# Altium schematic sheet MainSchematic.SchDoc
size OrCAD B; SheetNumber: 1; SheetTotal: 3
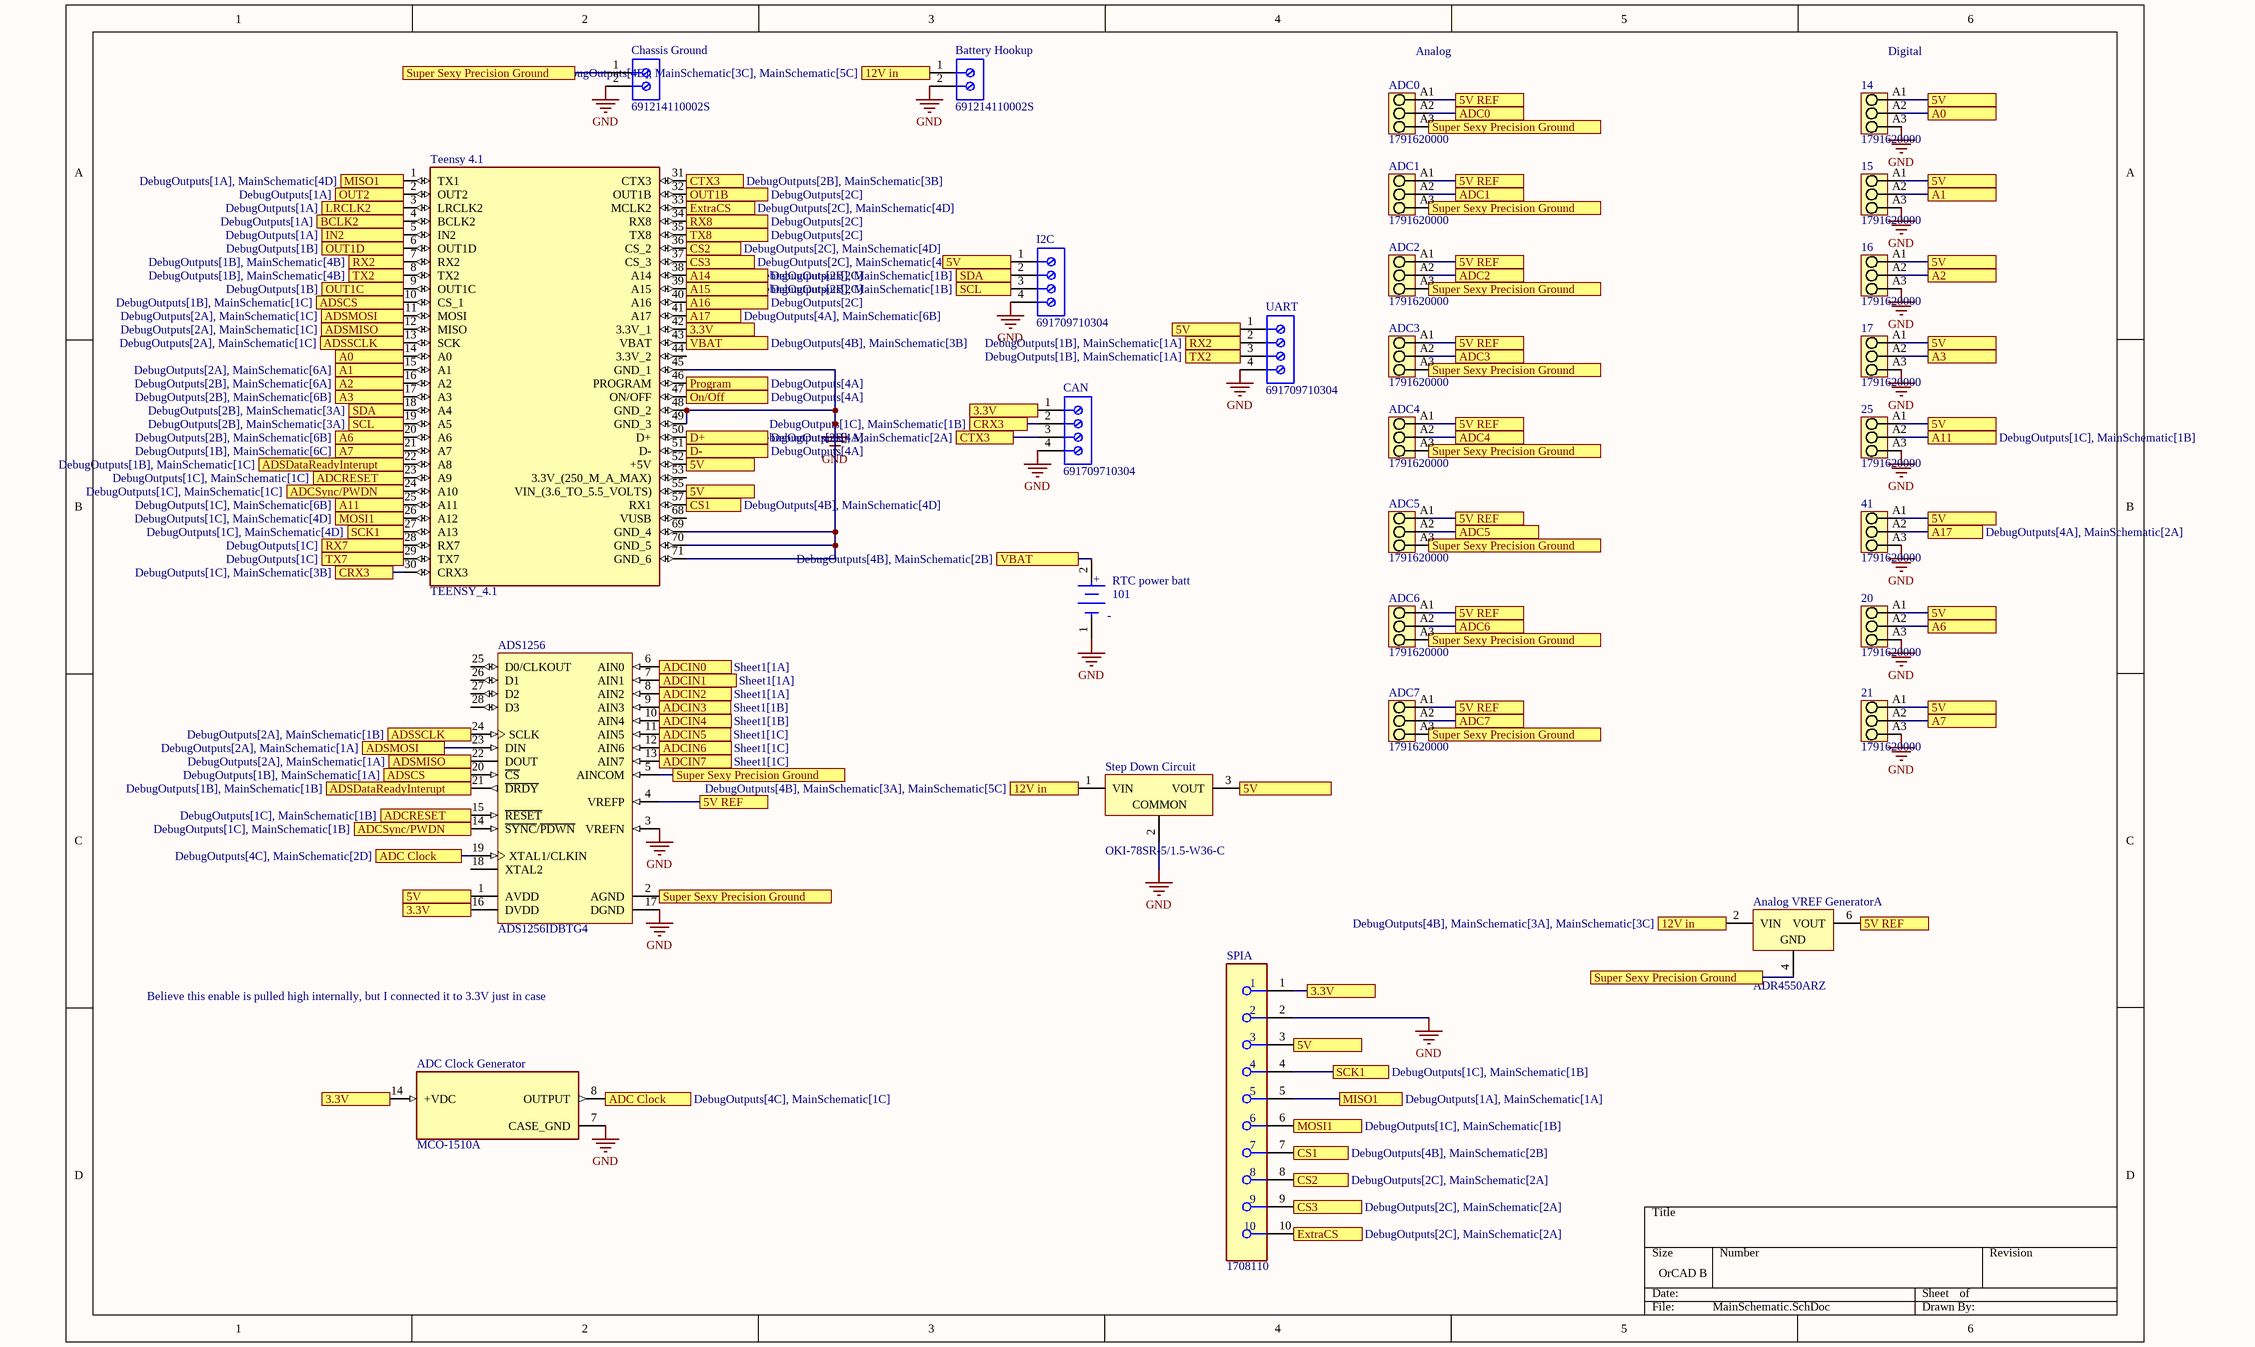
[diagram p0: MainSchematic.SchDoc]

## Parts
14  1791620000  [PM_5_00_90_03]
15  1791620000  [PM_5_00_90_03]
16  1791620000  [PM_5_00_90_03]
17  1791620000  [PM_5_00_90_03]
20  1791620000  [PM_5_00_90_03]
21  1791620000  [PM_5_00_90_03]
25  1791620000  [PM_5_00_90_03]
41  1791620000  [PM_5_00_90_03]
ADC0  1791620000  [PM_5_00_90_03]
ADC1  1791620000  [PM_5_00_90_03]
ADC2  1791620000  [PM_5_00_90_03]
ADC3  1791620000  [PM_5_00_90_03]
ADC4  1791620000  [PM_5_00_90_03]
ADC5  1791620000  [PM_5_00_90_03]
ADC6  1791620000  [PM_5_00_90_03]
ADC7  1791620000  [PM_5_00_90_03]
ADC_Clock_Generator  MCO-1510A  [OSC_ECS-100AX-500]
ADS1256  ADS1256IDBTG4  [TI-DB28_L]
Analog_VREF_Generator  ADR4550ARZ  [ADI-R-8_N]  (part A of 2)
Battery_Hookup  691214110002S  [691214110002S]
CAN  691709710304  [691709710304]
Chassis_Ground  691214110002S  [691214110002S]
I2C  691709710304  [691709710304]
RTC_power_batt  101  [FP-101-MFG]
SPI  1708110  [FP-1708110-MFG]  (part A of 2)
Step_Down_Circuit  OKI-78SR-5/1.5-W36-C  [MURA-OKI-78SR-3]
Teensy_4.1  TEENSY_4.1  [TEENSY41]
UART  691709710304  [691709710304]

## Ports
3.3V (see DebugOutputs[4B], MainSchematic[1C], MainSchematic[1D], MainSchematic[2A], MainSchematic[3B]), 3.3V (see DebugOutputs[4B], MainSchematic[1C], MainSchematic[1D], MainSchematic[2A], MainSchematic[4C]), 3.3V (see DebugOutputs[4B], MainSchematic[1C], MainSchematic[1D], MainSchematic[3B], MainSchematic[4C]), 3.3V (see DebugOutputs[4B], MainSchematic[1C], MainSchematic[2A], MainSchematic[3B], MainSchematic[4C]), 3.3V (see DebugOutputs[4B], MainSchematic[1D], MainSchematic[2A], MainSchematic[3B], MainSchematic[4C]), 5V (see DebugOutputs[4B], MainSchematic[1C], MainSchematic[2B], MainSchematic[3A], MainSchematic[4A], MainSchematic[4C], MainSchematic[4D], MainSchematic[6A], MainSchematic[6B]), 5V (see DebugOutputs[4B], MainSchematic[1C], MainSchematic[2B], MainSchematic[3A], MainSchematic[4A], MainSchematic[4C], MainSchematic[4D], MainSchematic[6A], MainSchematic[6B], MainSchematic[6C]), 5V (see DebugOutputs[4B], MainSchematic[1C], MainSchematic[2B], MainSchematic[3A], MainSchematic[4A], MainSchematic[4C], MainSchematic[6A], MainSchematic[6B], MainSchematic[6C]), 5V (see DebugOutputs[4B], MainSchematic[1C], MainSchematic[2B], MainSchematic[3A], MainSchematic[4A], MainSchematic[4D], MainSchematic[6A], MainSchematic[6B], MainSchematic[6C]), 5V (see DebugOutputs[4B], MainSchematic[1C], MainSchematic[2B], MainSchematic[3A], MainSchematic[4C], MainSchematic[4D], MainSchematic[6A], MainSchematic[6B], MainSchematic[6C]), 5V (see DebugOutputs[4B], MainSchematic[1C], MainSchematic[2B], MainSchematic[4A], MainSchematic[4C], MainSchematic[4D], MainSchematic[6A], MainSchematic[6B], MainSchematic[6C]), 5V (see DebugOutputs[4B], MainSchematic[2B], MainSchematic[3A], MainSchematic[4A], MainSchematic[4C], MainSchematic[4D], MainSchematic[6A], MainSchematic[6B], MainSchematic[6C]), 5V REF (see DebugOutputs[4B], MainSchematic[2C], MainSchematic[5A], MainSchematic[5B], MainSchematic[5C]), 5V REF (see DebugOutputs[4B], MainSchematic[2C], MainSchematic[5A], MainSchematic[5B], MainSchematic[5C], MainSchematic[6C]), 5V REF (see DebugOutputs[4B], MainSchematic[2C], MainSchematic[5A], MainSchematic[5B], MainSchematic[6C]), 5V REF (see DebugOutputs[4B], MainSchematic[5A], MainSchematic[5B], MainSchematic[5C], MainSchematic[6C]), 12V in (see DebugOutputs[4B], MainSchematic[3A], MainSchematic[3C]), 12V in (see DebugOutputs[4B], MainSchematic[3A], MainSchematic[5C]), 12V in (see DebugOutputs[4B], MainSchematic[3C], MainSchematic[5C]), A0 (see DebugOutputs[2A], MainSchematic[1B]), A0 (see DebugOutputs[2A], MainSchematic[6A]), A1 (see DebugOutputs[2A], MainSchematic[1B]), A1 (see DebugOutputs[2A], MainSchematic[6A]), A2 (see DebugOutputs[2B], MainSchematic[1B]), A2 (see DebugOutputs[2B], MainSchematic[6A]), A3 (see DebugOutputs[2B], MainSchematic[1B]), A3 (see DebugOutputs[2B], MainSchematic[6B]), A6 (see DebugOutputs[2B], MainSchematic[1B]), A6 (see DebugOutputs[2B], MainSchematic[6B]), A7 (see DebugOutputs[1B], MainSchematic[1B]), A7 (see DebugOutputs[1B], MainSchematic[6C]), A11 (see DebugOutputs[1C], MainSchematic[1B]), A11 (see DebugOutputs[1C], MainSchematic[6B]), A14 (see DebugOutputs[2C]), A15 (see DebugOutputs[2C]), A16 (see DebugOutputs[2C]), A17 (see DebugOutputs[4A], MainSchematic[2A]), A17 (see DebugOutputs[4A], MainSchematic[6B]), ADC0 (see DebugOutputs[4C], Sheet1[2A]), ADC1 (see DebugOutputs[4C], Sheet1[2A]), ADC2 (see DebugOutputs[4C], Sheet1[2A]), ADC3 (see DebugOutputs[4C], Sheet1[2B]), ADC4 (see DebugOutputs[4C], Sheet1[2B]), ADC5 (see DebugOutputs[4C], Sheet1[2C]), ADC6 (see DebugOutputs[4C], Sheet1[2C]), ADC7 (see DebugOutputs[4C], Sheet1[2C]), ADC Clock (see DebugOutputs[4C], MainSchematic[1C]), ADC Clock (see DebugOutputs[4C], MainSchematic[2D]), ADCIN0 (see Sheet1[1A]), ADCIN1 (see Sheet1[1A]), ADCIN2 (see Sheet1[1A]), ADCIN3 (see Sheet1[1B]), ADCIN4 (see Sheet1[1B]), ADCIN5 (see Sheet1[1C]), ADCIN6 (see Sheet1[1C]), ADCIN7 (see Sheet1[1C]), ADCRESET (see DebugOutputs[1C], MainSchematic[1B]), ADCRESET (see DebugOutputs[1C], MainSchematic[1C]), ADCSync/PWDN (see DebugOutputs[1C], MainSchematic[1B]), ADCSync/PWDN (see DebugOutputs[1C], MainSchematic[1C]), ADSCS (see DebugOutputs[1B], MainSchematic[1A]), ADSCS (see DebugOutputs[1B], MainSchematic[1C]), ADSDataReadyInterupt (see DebugOutputs[1B], MainSchematic[1B]), ADSDataReadyInterupt (see DebugOutputs[1B], MainSchematic[1C]), ADSMISO (see DebugOutputs[2A], MainSchematic[1A]), ADSMISO (see DebugOutputs[2A], MainSchematic[1C]), ADSMOSI (see DebugOutputs[2A], MainSchematic[1A]), ADSMOSI (see DebugOutputs[2A], MainSchematic[1C]), ADSSCLK (see DebugOutputs[2A], MainSchematic[1B]), ADSSCLK (see DebugOutputs[2A], MainSchematic[1C]), BCLK2 (see DebugOutputs[1A]), CRX3 (see DebugOutputs[1C], MainSchematic[1B]), CRX3 (see DebugOutputs[1C], MainSchematic[3B]), CS1 (see DebugOutputs[4B], MainSchematic[2B]), CS1 (see DebugOutputs[4B], MainSchematic[4D]), CS2 (see DebugOutputs[2C], MainSchematic[2A]), CS2 (see DebugOutputs[2C], MainSchematic[4D]), CS3 (see DebugOutputs[2C], MainSchematic[2A]), CS3 (see DebugOutputs[2C], MainSchematic[4D]), CTX3 (see DebugOutputs[2B], MainSchematic[2A]), CTX3 (see DebugOutputs[2B], MainSchematic[3B]), D+ (see DebugOutputs[4A]), D- (see DebugOutputs[4A]), ExtraCS (see DebugOutputs[2C], MainSchematic[2A]), ExtraCS (see DebugOutputs[2C], MainSchematic[4D]), IN2 (see DebugOutputs[1A]), LRCLK2 (see DebugOutputs[1A]), MISO1 (see DebugOutputs[1A], MainSchematic[1A]), MISO1 (see DebugOutputs[1A], MainSchematic[4D]), MOSI1 (see DebugOutputs[1C], MainSchematic[1B]), MOSI1 (see DebugOutputs[1C], MainSchematic[4D]), On/Off (see DebugOutputs[4A]), OUT1B (see DebugOutputs[2C]), OUT1C (see DebugOutputs[1B]), OUT1D (see DebugOutputs[1B]), OUT2 (see DebugOutputs[1A]), Program (see DebugOutputs[4A]), RX2 (see DebugOutputs[1B], MainSchematic[1A]), RX2 (see DebugOutputs[1B], MainSchematic[4B]), RX7 (see DebugOutputs[1C]), RX8 (see DebugOutputs[2C]), SCK1 (see DebugOutputs[1C], MainSchematic[1B]), SCK1 (see DebugOutputs[1C], MainSchematic[4D]), SCL (see DebugOutputs[2B], MainSchematic[1B]), SCL (see DebugOutputs[2B], MainSchematic[3A]), SDA (see DebugOutputs[2B], MainSchematic[1B]), SDA (see DebugOutputs[2B], MainSchematic[3A]), Super Sexy Precision Ground (see MainSchematic[1A], MainSchematic[2C], MainSchematic[4A], MainSchematic[4B], MainSchematic[4C], MainSchematic[5C], Sheet1[1A], Sheet1[1B], Sheet1[1C]), Super Sexy Precision Ground (see MainSchematic[1A], MainSchematic[2C], MainSchematic[4A], MainSchematic[4B], MainSchematic[4C], Sheet1[1A], Sheet1[1B], Sheet1[1C]), Super Sexy Precision Ground (see MainSchematic[1A], MainSchematic[2C], MainSchematic[4A], MainSchematic[4B], MainSchematic[5C], Sheet1[1A], Sheet1[1B], Sheet1[1C]), Super Sexy Precision Ground (see MainSchematic[2C], MainSchematic[4A], MainSchematic[4B], MainSchematic[4C], MainSchematic[5C], Sheet1[1A], Sheet1[1B], Sheet1[1C]), TX2 (see DebugOutputs[1B], MainSchematic[1A]), TX2 (see DebugOutputs[1B], MainSchematic[4B]), TX7 (see DebugOutputs[1C]), TX8 (see DebugOutputs[2C]), VBAT (see DebugOutputs[4B], MainSchematic[2B]), VBAT (see DebugOutputs[4B], MainSchematic[3B])

## Nets
GND: 14.A3 15.A3 16.A3 17.A3 20.A3 21.A3 25.A3 41.A3 ADC_Clock_Generator.7(CASE_GND) ADS1256.3(VREFN) ADS1256.17(DGND) Battery_Hookup.2 CAN.4 Chassis_Ground.2 I2C.4 RTC_power_batt.1(C) SPI.2 Step_Down_Circuit.2(COMMON) Teensy_4.1.45(GND_1) Teensy_4.1.48(GND_2) Teensy_4.1.49(GND_3) Teensy_4.1.69(GND_4) Teensy_4.1.70(GND_5) Teensy_4.1.71(GND_6) UART.4
3.3V: ADC_Clock_Generator.14(+VDC) ADS1256.16(DVDD) CAN.1 SPI.1 Teensy_4.1.42(3.3V_1) ; port 3.3V
5V: 14.A1 15.A1 16.A1 17.A1 20.A1 21.A1 25.A1 41.A1 ADS1256.1(AVDD) I2C.1 SPI.3 Step_Down_Circuit.3(VOUT) Teensy_4.1.52(+5V) Teensy_4.1.55(VIN_(3.6_TO_5.5_VOLTS)) UART.1 ; port 5V
5V REF: ADC0.A1 ADC1.A1 ADC2.A1 ADC3.A1 ADC4.A1 ADC5.A1 ADC6.A1 ADC7.A1 ADS1256.4(VREFP) Analog_VREF_Generator.6(VOUT) ; port 5V REF
12V in: Analog_VREF_Generator.2(VIN) Battery_Hookup.1 Step_Down_Circuit.1(VIN) ; port 12V in
A0: 14.A2 Teensy_4.1.14(A0) ; port A0
A1: 15.A2 Teensy_4.1.15(A1) ; port A1
A2: 16.A2 Teensy_4.1.16(A2) ; port A2
A3: 17.A2 Teensy_4.1.17(A3) ; port A3
A6: 20.A2 Teensy_4.1.20(A6) ; port A6
A7: 21.A2 Teensy_4.1.21(A7) ; port A7
A11: 25.A2 Teensy_4.1.25(A11) ; port A11
A14: Teensy_4.1.38(A14) ; port A14
A15: Teensy_4.1.39(A15) ; port A15
A16: Teensy_4.1.40(A16) ; port A16
A17: 41.A2 Teensy_4.1.41(A17) ; port A17
ADC0: ADC0.A2 ; port ADC0
ADC1: ADC1.A2 ; port ADC1
ADC2: ADC2.A2 ; port ADC2
ADC3: ADC3.A2 ; port ADC3
ADC4: ADC4.A2 ; port ADC4
ADC5: ADC5.A2 ; port ADC5
ADC6: ADC6.A2 ; port ADC6
ADC7: ADC7.A2 ; port ADC7
ADC Clock: ADC_Clock_Generator.8(OUTPUT) ADS1256.19(XTAL1/CLKIN) ; port ADC Clock
ADCIN0: ADS1256.6(AIN0) ; port ADCIN0
ADCIN1: ADS1256.7(AIN1) ; port ADCIN1
ADCIN2: ADS1256.8(AIN2) ; port ADCIN2
ADCIN3: ADS1256.9(AIN3) ; port ADCIN3
ADCIN4: ADS1256.10(AIN4) ; port ADCIN4
ADCIN5: ADS1256.11(AIN5) ; port ADCIN5
ADCIN6: ADS1256.12(AIN6) ; port ADCIN6
ADCIN7: ADS1256.13(AIN7) ; port ADCIN7
ADCRESET: ADS1256.15(~{RESET}) Teensy_4.1.23(A9) ; port ADCRESET
ADCSync/PWDN: ADS1256.14(~{SYNC}/~{PDWN}) Teensy_4.1.24(A10) ; port ADCSync/PWDN
ADSCS: ADS1256.20(~{CS}) Teensy_4.1.10(CS_1) ; port ADSCS
ADSDataReadyInterupt: ADS1256.21(~{DRDY}) Teensy_4.1.22(A8) ; port ADSDataReadyInterupt
ADSMISO: ADS1256.22(DOUT) Teensy_4.1.12(MISO) ; port ADSMISO
ADSMOSI: ADS1256.23(DIN) Teensy_4.1.11(MOSI) ; port ADSMOSI
ADSSCLK: ADS1256.24(SCLK) Teensy_4.1.13(SCK) ; port ADSSCLK
BCLK2: Teensy_4.1.4(BCLK2) ; port BCLK2
CRX3: CAN.2 Teensy_4.1.30(CRX3) ; port CRX3
CS1: SPI.7 Teensy_4.1.57(RX1) ; port CS1
CS2: SPI.8 Teensy_4.1.36(CS_2) ; port CS2
CS3: SPI.9 Teensy_4.1.37(CS_3) ; port CS3
CTX3: CAN.3 Teensy_4.1.31(CTX3) ; port CTX3
D+: Teensy_4.1.50(D+) ; port D+
D-: Teensy_4.1.51(D-) ; port D-
ExtraCS: SPI.10 Teensy_4.1.33(MCLK2) ; port ExtraCS
IN2: Teensy_4.1.5(IN2) ; port IN2
LRCLK2: Teensy_4.1.3(LRCLK2) ; port LRCLK2
MISO1: SPI.5 Teensy_4.1.1(TX1) ; port MISO1
MOSI1: SPI.6 Teensy_4.1.26(A12) ; port MOSI1
On/Off: Teensy_4.1.47(ON/OFF) ; port On/Off
OUT1B: Teensy_4.1.32(OUT1B) ; port OUT1B
OUT1C: Teensy_4.1.9(OUT1C) ; port OUT1C
OUT1D: Teensy_4.1.6(OUT1D) ; port OUT1D
OUT2: Teensy_4.1.2(OUT2) ; port OUT2
Program: Teensy_4.1.46(PROGRAM) ; port Program
RX2: Teensy_4.1.7(RX2) UART.2 ; port RX2
RX7: Teensy_4.1.28(RX7) ; port RX7
RX8: Teensy_4.1.34(RX8) ; port RX8
SCK1: SPI.4 Teensy_4.1.27(A13) ; port SCK1
SCL: I2C.3 Teensy_4.1.19(A5) ; port SCL
SDA: I2C.2 Teensy_4.1.18(A4) ; port SDA
Super Sexy Precision Ground: ADC0.A3 ADC1.A3 ADC2.A3 ADC3.A3 ADC4.A3 ADC5.A3 ADC6.A3 ADC7.A3 ADS1256.2(AGND) ADS1256.5(AINCOM) Analog_VREF_Generator.4(GND) Chassis_Ground.1 ; port Super Sexy Precision Ground
TX2: Teensy_4.1.8(TX2) UART.3 ; port TX2
TX7: Teensy_4.1.29(TX7) ; port TX7
TX8: Teensy_4.1.35(TX8) ; port TX8
VBAT: RTC_power_batt.2(A) Teensy_4.1.43(VBAT) ; port VBAT

Not connected (* = marked no-connect by the designer): ADS1256 18(XTAL2) 25(D0/CLKOUT) 26(D1) 27(D2) 28(D3); Teensy_4.1 44(3.3V_2) 53(3.3V_(250_M_A_MAX)) 68(VUSB)

## Notes on the sheet
- (near ADC0) Analog
- (near 14) Digital
- Believe this enable is pulled high internally, but I connected it to 3.3V just in case
- (in symbol CMP-19636-000018-1) +

## Library data of the parts
14-17 20 21 25 41 ADC0-ADC7 = CMP-1559-01624-1: OMNIMATE Signal - series PM; Manufacturer: Weidmueller; Mounting_onto_the_PCB: Solder connection; Pitch_mm: 5 mm; Solder_pin_length_mm: 3,5 mm; Solid_max_H05_07_V_U: 2,5 mm²; Wire_cross_section_AWG_max_UL_1059: AWG 14; Rated_voltage_use_group_B_UL_1059: 300 V; Pitch_inch: 0,197 inch; UL_94_flammability_rating: V-0; Insulating_material: Wemid (PA); No_of_poles: 3; Solid_min_H05_07_V_U: 0,13 mm²; Contact_material: Cu-Leg; Short_text_for_material: PM 5.00/03/90 3.5SN OR BX; Rated_voltage_for_surge_voltage_class_pollution_degree_II_2: 600 V; Side_termination_characteristic: closed side; Wire_cross_section_AWG_min_UL_1059: AWG 26; Contact_surface: tinned; Rated_current_use_group_B_UL_1059: 15 A; ComponentLink2Description: URL Link1; Revision: V1; Colour: Orange; ComponentLink1URL: http://www.weidmueller.com/; Packaging: Box; Qty: 500 PCS; PackageReference: PM_5_00_90_03; PartNumber: 1791620000; ComponentLink2URL: http://catalog.weidmueller.com/catalog/Start.do?localeId=en&ObjectID=1791620000; ComponentLink1Description: Manufacturer URL
ADC_Clock_Generator = ECS-100AX-500: Oscillator  14-DIP, 4 Leads (Full Size, Metal Can); Package: None; Price: None; Value: *; MP: ECS-100AX-500; Availability: Unavailable
ADS1256 = CMP-0003-00153-1: 24-Bit, 30 kSPS Very Low Noise Delta-Sigma ADC with Multiplexer, -40 to 85 degC, 28-pin SOP (DB28), Green (RoHS & no Sb/Br); Manufacturer: Texas Instruments; SubFamily: Precision ADC (<=10MSPS); Analog Voltage AV/DD(Min)(V): 4.75; Digital Supply(Max)(V): 3.6; Digital Supply(Min)(V): 1.8; Resolution(Bits): 24; Analog Voltage AV/DD(Max)(V): 5.25; Sample Rate (max)(SPS): 30k; # Input Channels: 8; Interface: Serial SPI; Mounting Technology: Surface Mount; Architecture: Delta-Sigma; DatasheetVersion: SBAS288J; ComponentLink3Description: Package Specification; Eco-Plan: Green (RoHS & no Sb/Br); Code_JEDEC: MO-150; PackageDescription: 28-Pin Plastic Small Outline, Body 10.2 X 5.3 mm, Pitch 0.65 mm; ComponentLink3URL: http://www.ti.com/lit/ml/msso002e/msso002e.pdf; ComponentLink1Description: Manufacturer URL; ComponentLink1URL: http://www.ti.com/; PartNumber: ADS1256IDBTG4; ComponentLink2URL: http://www.ti.com/general/docs/lit/getliterature.tsp?genericPartNumber=ADS1256&fileType=pdf; PackageReference: DB28; PackageVersion: 4040065/E, 12/2001; ComponentLink2Description: Datasheet
Analog_VREF_Generator = CMP-0784-00194-1: Ultralow Noise, High Accuracy Voltage Reference, 5 V Output, 3 to 15 V Supply, Industrial, 8-pin SOIC (R-8), Tube; Manufacturer: Analog Devices; Vout: 5V; Max V Supply (V): 15; Min V Supply (V): 3; Ref Out TC (ppm/C): 4; PackageReference: R-8; PackageDescription: 8-Pin Standard Small Outline Package, Body 4.9 x 3.9 mm, Pitch 1.27 mm; PackageVersion: 060506-A, 06/2006; Operating Temp Range: -40 to 125 degC; DatasheetVersion: Rev. 0; ComponentLink1URL: http://www.analog.com/en/index.html; PartNumber: ADR4550ARZ; Mounting Technology: Surface Mount; ComponentLink2URL: http://www.analog.com/static/imported-files/data_sheets/ADR4520_4525_4530_4533_4540_4550.pdf; ComponentLink2Description: Datasheet; ComponentLink3Description: Package Specification; ComponentLink3URL: http://www.analog.com/static/imported-files/packages/PKG_PDF/SOIC_Narrow%20(R)/R_8.pdf; Packing: Tube; ComponentLink1Description: Manufacturer URL; Code_JEDEC: MS-012-AA; ComponentLink4Description: URL Link1; ComponentLink4URL: Product URL:http://www.analog.com/en/special-linear-functions/voltage-references/adr4550/products/product.html
Battery_Hookup Chassis_Ground = CMP-1502-02465-2: NexarPartId: 94172715; Voltage Rating: 300V; Number of Contacts: 2; Current Rating: 10A; Lead Pitch: 3.5mm; Height: 9.2mm; Min Operating Temperature: -30°C; Number of Pins: 2; Packaging: Box; Max Operating Temperature: 120°C; Contact Material: Nickel, Tin; Number of Rows: 1
CAN I2C UART = CMP-1502-03337-2: NexarPartId: 34171771; Current: 6A; Voltage: 300V; Number of Positions Per Level: 4; Plating: Steel; Wire Gauge (Max): 30AWG; Pitch: 5mm; Connector Type: Screw; Number of Levels: 1; Color: Black; Lead Pitch: 5mm; Mount: Surface Mount; Flammability Rating: UL94 V-0; Termination: Screw; Housing Material: Nylon; Min Operating Temperature: -40°C; REACH SVHC: Unknown; Number of Pins: 4; Contact Plating: Tin; Packaging: Digi-Reel®; Height: 10.2mm; Number of Rows: 1; Number of Positions: 4; Contact Material: Nickel; Current Rating: 6A; Wire Gauge (Min): 30AWG; Voltage Rating: 300V; Length: 20mm; Wire/Cable Gauge: 30AWG; RoHS: Compliant; Number of Contacts: 4; Max Operating Temperature: 130°C
RTC_power_batt = CMP-19636-000018-1: BATTERY HOLDER COIN 20MM PC PIN; Body Material: PBT; Number of Batteries: 1; Packaging: Bag; Lead Free: Lead Free; Package Quantity: 1; Contact Plating: Tin; Termination: PC Pin; REACH SVHC: No SVHC; Material: Steel; Mount: Through Hole; Max Operating Temperature: 145°C; Min Operating Temperature: -50°C; Number of Cells: 1; Series: -
SPI = CMP-00298-00058710-1: 1708110 10 Position Wire to Board Terminal Block Horizontal with Board 0.150" (3.81mm) Through Hole; NexarPartId: 58710; Number of Circuits: 20; Max Current Rating: 10A; Gender: Male; Stripping Length: 5mm; Connector Type: Screw; Voltage: 300V; Number of Poles: 10; Wire Gauge (Min): 26AWG; Wire Gauge (Max): 30AWG; Current Rating: 8A; Number of Levels: 2; Voltage Rating: 200V; Approvals: CB, CSA, UL, cULus; Width: 16.3mm; Ambient Temperature Range High: 105°C; Depth: 16.2mm; Min Operating Temperature: -40°C; Number of Rows: 2; Contact Material: Tin; Termination: Screw; Mount: Through Hole; Housing Color: Green; RoHS: Compliant; Pitch: 3.81mm; Color: Green; Housing Material: Nylon; Insulation Material: Nylon; Number of Contacts: 10; Current: 10A; Max Operating Temperature: 105°C; Number of Positions Per Level: 10; Flammability Rating: UL94 V-0; Length: 38.1mm; Material: Polyamide; Number of Positions: 10; Lead Free: Lead Free; Weight: 1.360777kg; Height: 16.2mm; Number of Pins: 20; Orientation: Straight
Step_Down_Circuit = CMP-2000-05274-1: Non-Isolated DC/DC Converter, 7.5 W, 7 to 36 V, 1.5 A, -40 to 85 degC, 3-Pin THD, RoHS; Manufacturer: Murata; Current - Output (Max): 1.5A; Power (Watts) - Max: 8W; Efficiency: 90.5%; Voltage - Input (Min): 7V; Voltage - Input (Max): 36V; Voltage - Output 1: 5V; Number of Outputs: 1; Package / Case: 3-SIPModule; Features: SCP; Type: LinearRegulatorReplacement; Size / Dimension: 0.41"Lx0.30"Wx0.65"H(10.4mmx7.6mmx16.5mm); Datasheet URL: https://datasheet.ciiva.com/8006/1790439-8006672.pdf; Datasheet Version: Oct-13; Power (Watts) - Manufacture Series: 8W; Voltage - Output 2: -; Series: Okami™OKI-78SR; Family: DCDCConverters; Manufacturer URL: http://www.murata.com/; Category: PowerSupplies-BoardMount; Voltage - Isolation: -; Packaging: Tube; Applications: ITE(Commercial); Mounting Type: ThroughHole; Voltage - Output 3: -; Operating Temperature: -40degC~85degC
Teensy_4.1 = TEENSY_4.1: <b>Teensy 4.1 Development Board</b><p> Source: <a href="https://www.pjrc.com/store/teensy41.html"> Datasheet </a>; MF: PJRC; SnapEDA_Link: https://www.snapeda.com/parts/Teensy%204.1/PJRC/view-part/?ref=snap; Package: None; Value: *; MP: Teensy 4.1; Check_prices: https://www.snapeda.com/parts/Teensy%204.1/PJRC/view-part/?ref=eda